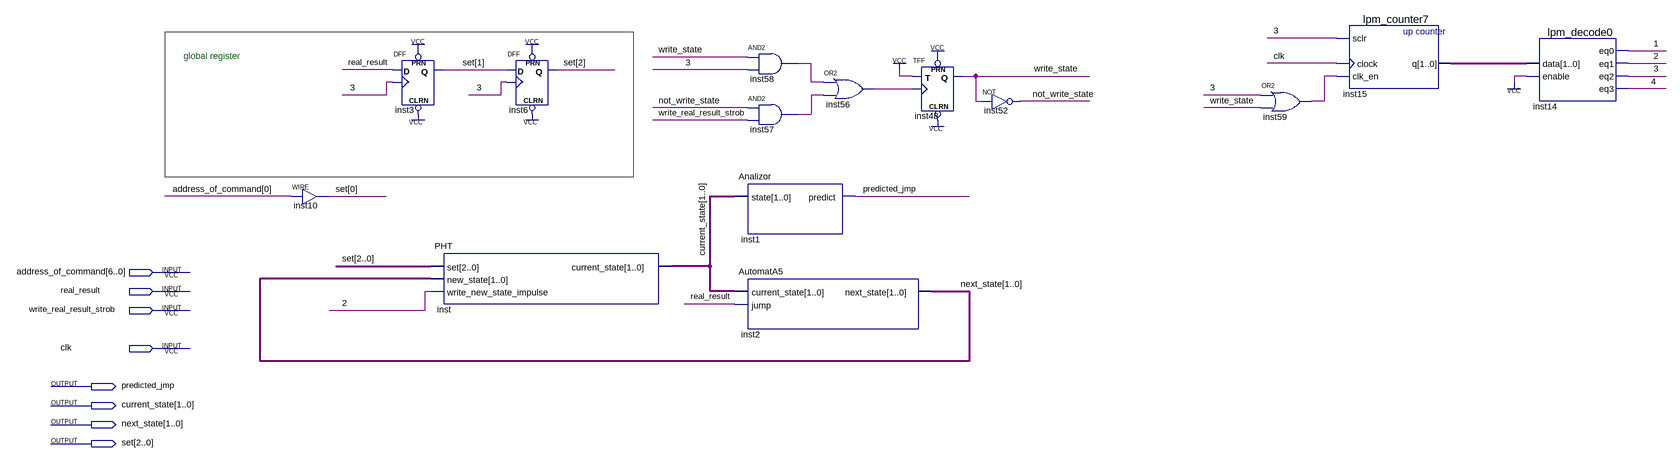
[diagram p0: schematic sheet]
// Quartus schematic Oracle.bdf as structural Verilog: 14 symbols, 8 pins
module Oracle (
  input  [6:0] address_of_command,
  input  real_result,
  input  write_real_result_strob,
  input  clk,
  output predicted_jmp,
  output [1:0] current_state,
  output [1:0] next_state,
  output [2:0] set
);

  wire \1 , \2 , \3 , \4 , inst56_out, inst57_out, inst58_out, inst59_out, not_write_state, write_state;
  wire [1:0] inst15_q;

  assign set[0] = address_of_command[0];  // WIRE inst10
  DFF inst3 (.CLRN(1'b1), .CLK(\3 ), .D(real_result), .PRN(1'b1), .Q(set[1]));
  PHT inst (.set(set), .new_state(next_state), .write_new_state_impulse(\2 ), .current_state(current_state));
  DFF inst6 (.CLRN(1'b1), .CLK(\3 ), .D(set[1]), .PRN(1'b1), .Q(set[2]));
  and inst58 (inst58_out, write_state, \3 );
  and inst57 (inst57_out, not_write_state, write_real_result_strob);
  Analizor inst1 (.state(current_state), .predict(predicted_jmp));
  AutomatA5 inst2 (.current_state(current_state), .jump(real_result), .next_state(next_state));
  or inst56 (inst56_out, inst58_out, inst57_out);
  TFF inst48 (.PRN(1'b1), .CLRN(1'b1), .T(1'b1), .CLK(inst56_out), .Q(write_state));
  not inst52 (not_write_state, write_state);
  or inst59 (inst59_out, \3 , write_state);
  lpm_counter7 inst15 (.sclr(\3 ), .clock(clk), .clk_en(inst59_out), .q(inst15_q));
  lpm_decode0 inst14 (.data(inst15_q), .enable(1'b1), .eq0(\1 ), .eq1(\2 ), .eq2(\3 ), .eq3(\4 ));

  // Notes on the sheet:
  //   global register
endmodule
